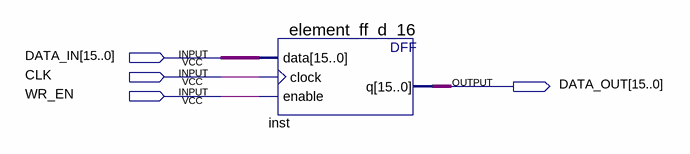
[diagram p0: schematic sheet]
// Quartus schematic block-register-16.bdf as structural Verilog: 1 symbols, 4 pins
module \block-register-16  (
  input  [15:0] DATA_IN,
  input  CLK,
  input  WR_EN,
  output [15:0] DATA_OUT
);

  element_ff_d_16 inst (.data(DATA_IN), .clock(CLK), .enable(WR_EN), .q(DATA_OUT));
endmodule
